# EAGLE design zener_diode v1 (EAGLE 9.7.0)
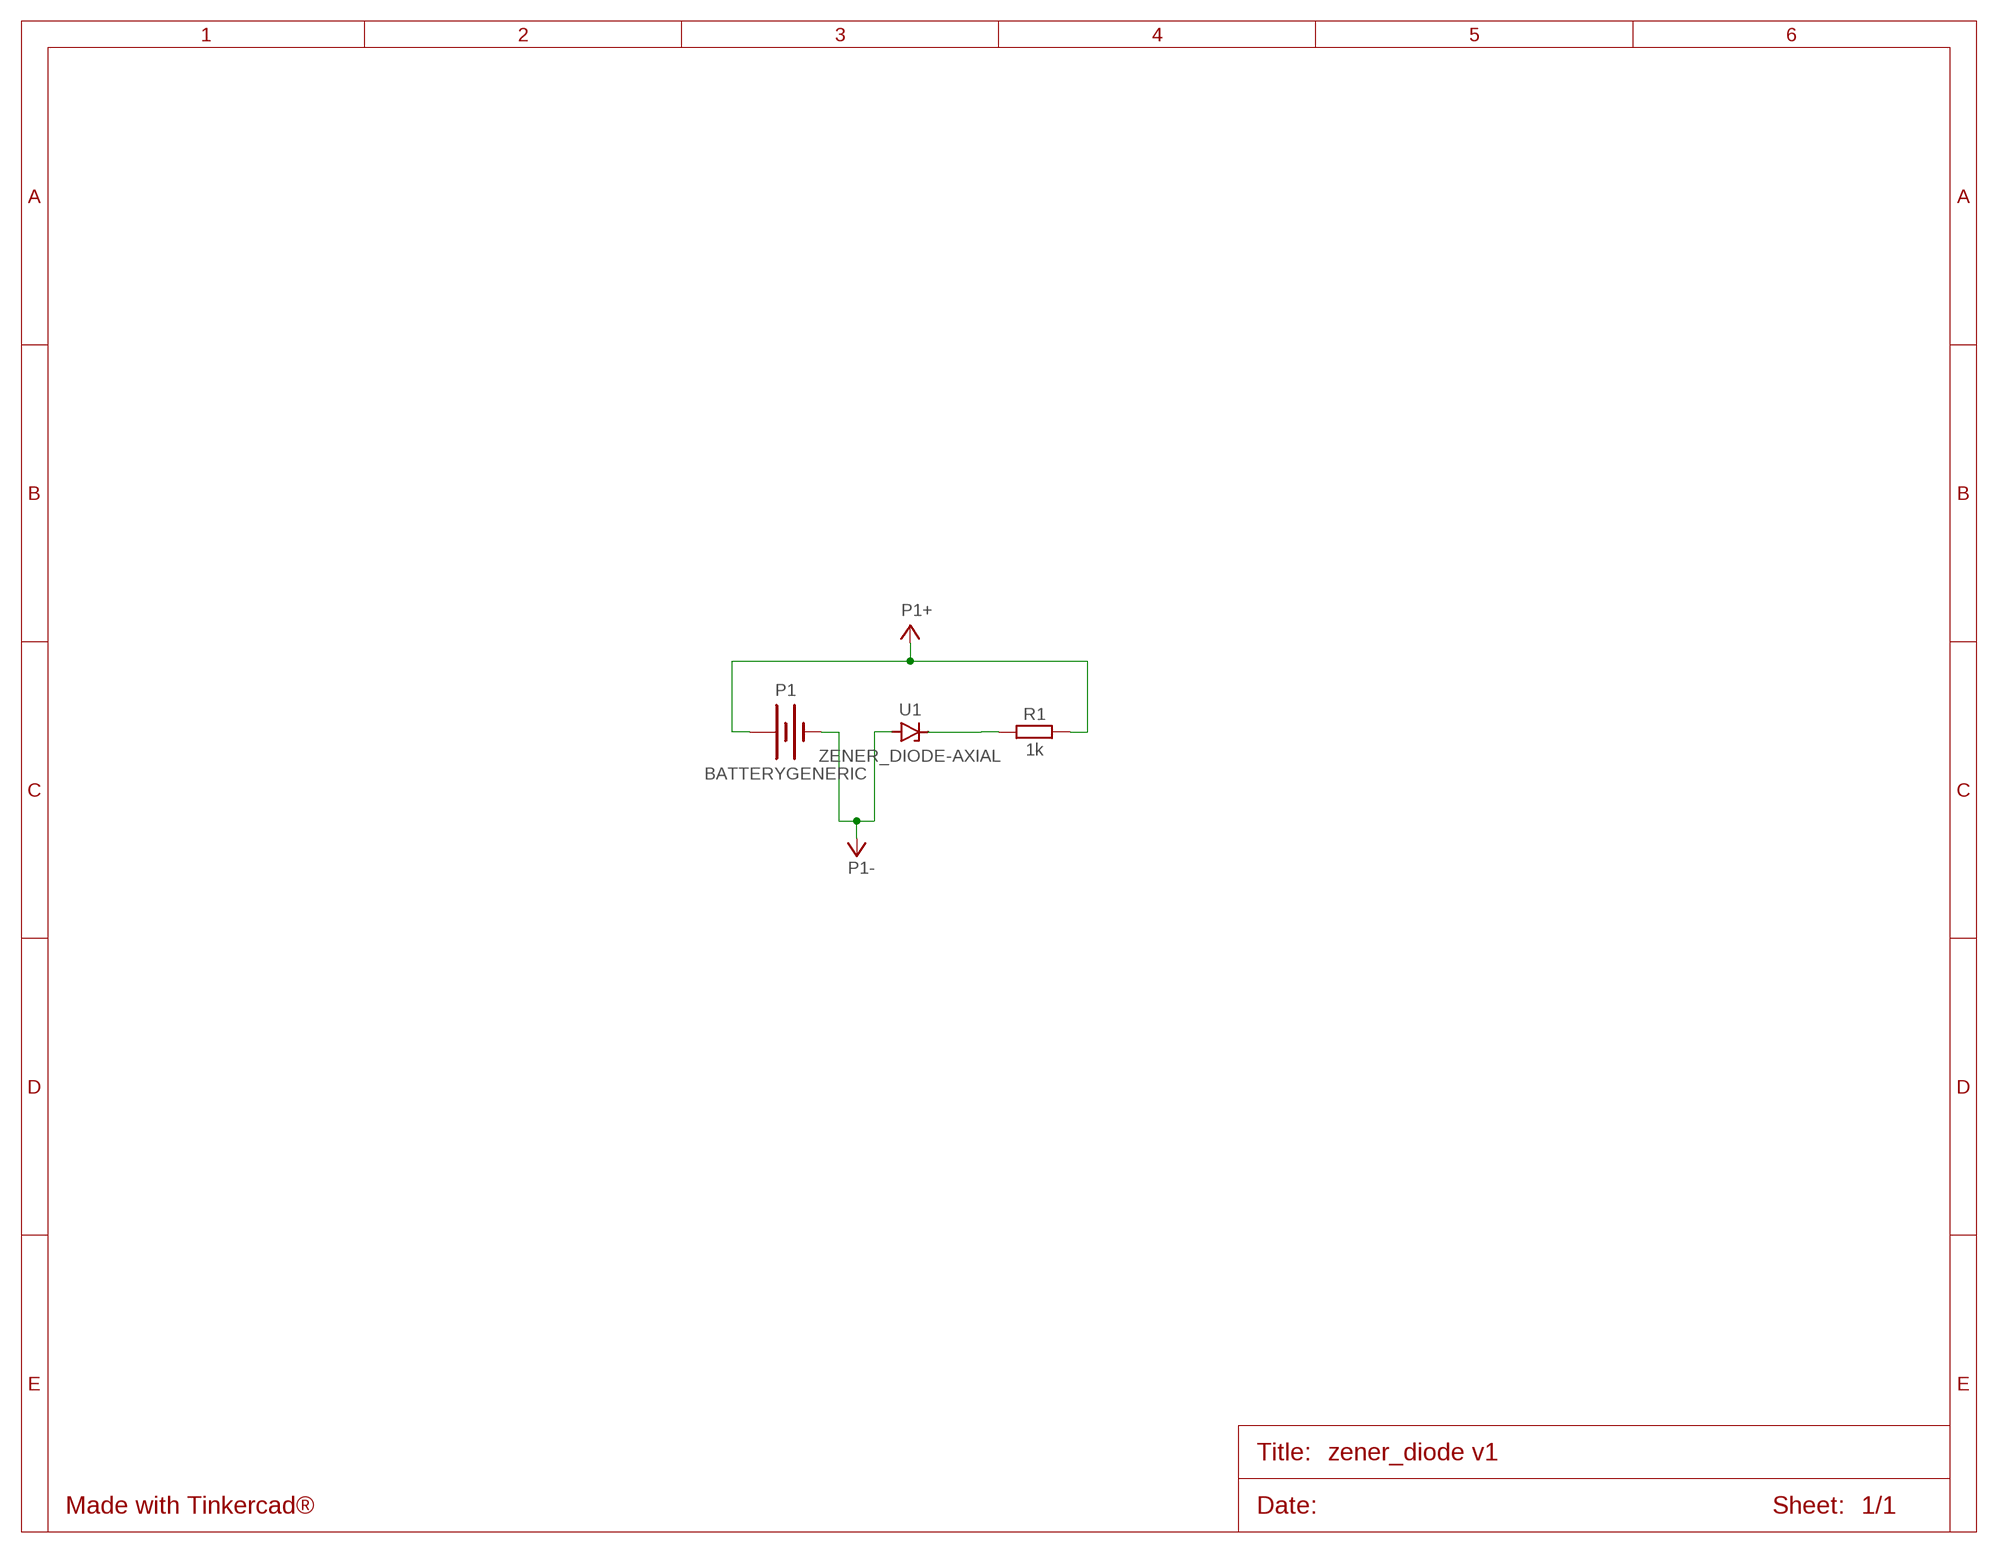
[diagram p0: schematic, sheet 1]

## Parts
P1  BATTERYGENERIC  [BATTERY-GENERIC]
R1  1k  RESISTOR_AXIAL-10.16MM-PITCH  [RESAD1016W63L850D250B]
U1  ZENER_DIODE-AXIAL  [DIODE-AXIAL]

## Nets
P1+: P1.+ R1.1
P1-: P1.- U1.1(A)
R1_2: R1.2 U1.2(C)

## Library data of the parts
P1 = Tinkercad:BATTERY
R1 = Tinkercad:RESISTOR: Resistor Fixed - Generic
U1 = Tinkercad:ZENER: Zener Diode - Generic

## Board
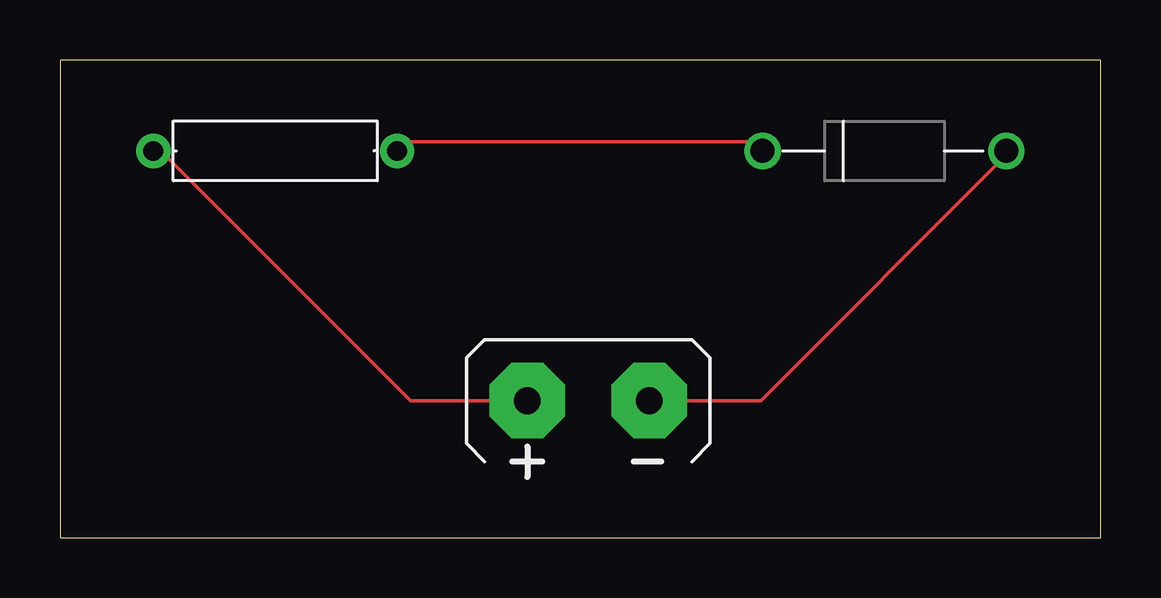
[diagram p1: board, top side]

Size 43.38 x 19.91 mm. Coordinates in mm from the lower left corner, seen from the top.
Outline: 0,0 43.38,0 43.38,19.91 0,19.91 0,0
Copper layers (1*16): Top 0.035mm / dielectric 1.5mm / Bottom 0.035mm
Design rules "default": minimum track width 6mil, minimum drill 0.35mm, track to track 6mil, track to pad 6mil, pad to pad 6mil, via to via 6mil, smd to smd 6mil, copper to edge 40mil, drill to drill 6mil, minimum pad ring 10mil, minimum via ring 8mil, stop-mask expansion 4mil, vias tented up to drill 0mil, thermal gap 10mil

### Footprints (pad centres in the part's own frame; a part is rotated, then mirrored left to right if it is on the bottom)
BATTERY-GENERIC = drill 1.118 pad 3.15 octagon: + 2.54,0; - -2.54,0
RESAD1016W63L850D250B = drill 0.83 pad 1.43: 1 -5.08,0; 2 5.08,0
DIODE-AXIAL = drill 1: 1 -5.08,0; 2 5.08,0

### Placement (x,y rotation side)
P1  22.02,5.71 180 top
R1  8.97,16.12 0 top
U1  34.37,16.12 180 top

### Tracks (layer width: path | path; a pad name or v marks a point on that pad's centre or on a via)
P1+
  Top 0.152: P1.+ 14.61,5.71 4.45,15.88 R1.1
P1-
  Top 0.152: P1.- 29.21,5.71 39.37,15.88 U1.1
R1_2
  Top 0.152: R1.2 14.61,16.51 29.21,16.51 U1.2